# Altium schematic sheet Modulo_Potencia_CEDCP.SchDoc
size A4
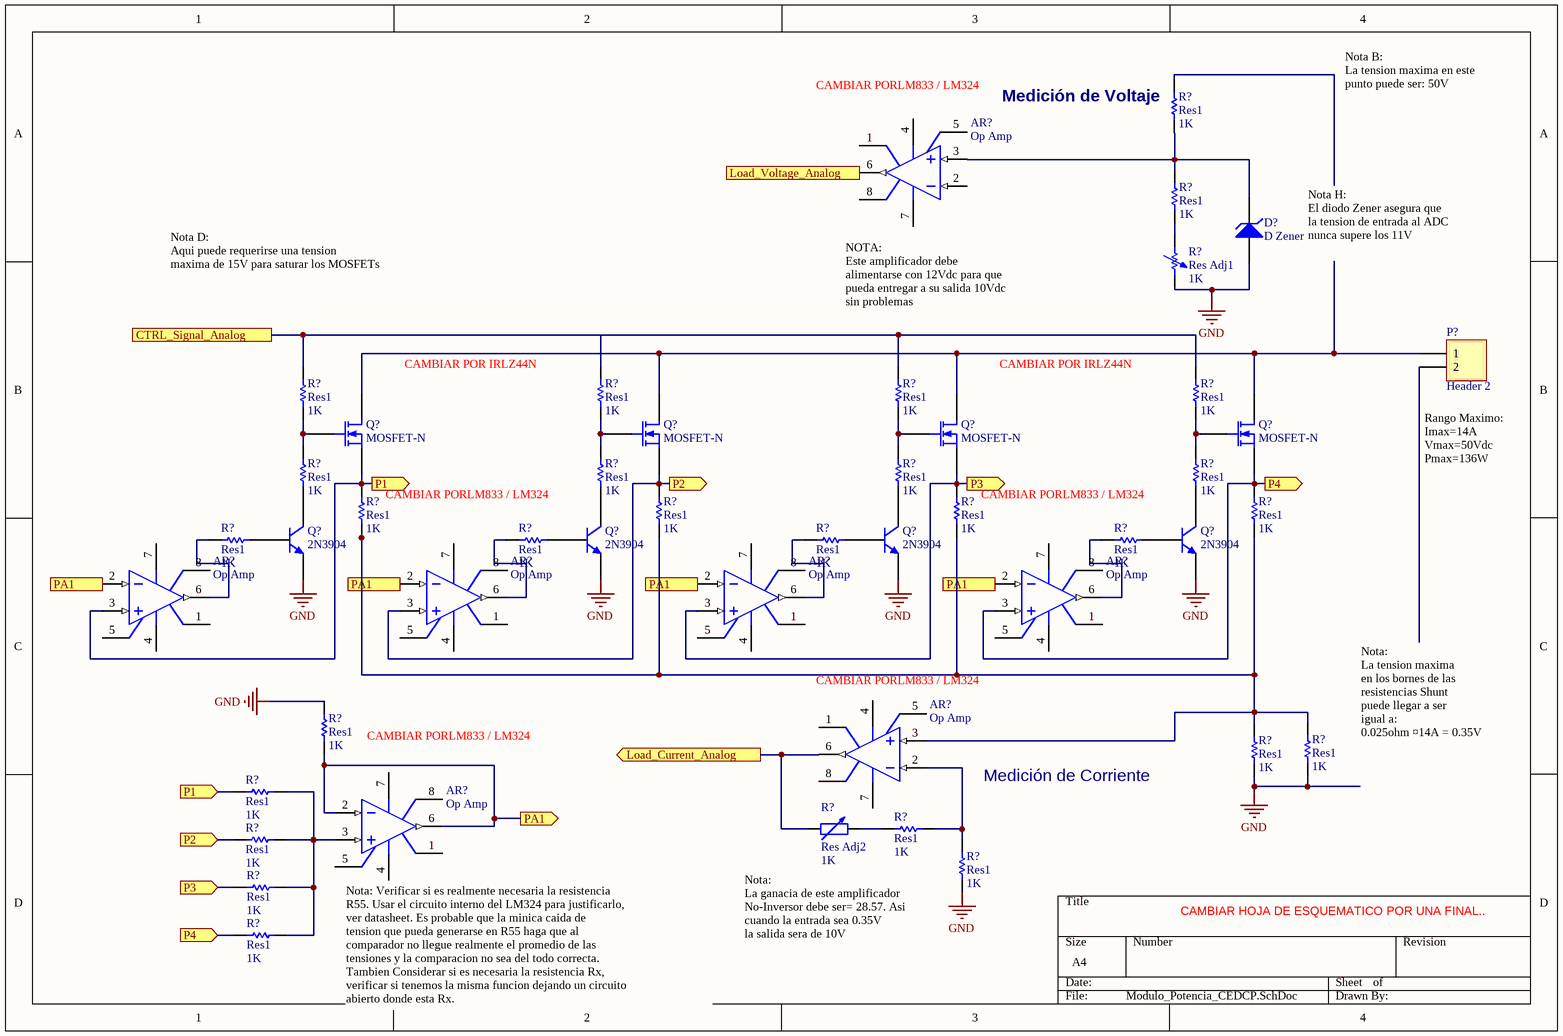
[diagram p0: Modulo_Potencia_CEDCP.SchDoc]

## Parts
(Parts that share a designator on the sheet are numbered #1, #2 ... from top to bottom, then left to right.)
AR?#1  Op Amp  [H-08A]
AR?#2  Op Amp  [H-08A]
AR?#3  Op Amp  [H-08A]
AR?#4  Op Amp  [H-08A]
AR?#5  Op Amp  [H-08A]
AR?#6  Op Amp  [H-08A]
AR?#7  Op Amp  [H-08A]
D?  D Zener  [DIODE-0.7]
P?  Header 2  [HDR1X2]
Q?#1  MOSFET-N  [E3]
Q?#2  MOSFET-N  [E3]
Q?#3  MOSFET-N  [E3]
Q?#4  MOSFET-N  [E3]
Q?#5  2N3904  [TO-92A]
Q?#6  2N3904  [TO-92A]
Q?#7  2N3904  [TO-92A]
Q?#8  2N3904  [TO-92A]
R?#1  Res1  value 1K  [AXIAL-0.3]
R?#2  Res1  value 1K  [AXIAL-0.3]
R?#3  Res Adj1  value 1K  [AXIAL-0.7]
R?#4  Res1  value 1K  [AXIAL-0.3]
R?#5  Res1  value 1K  [AXIAL-0.3]
R?#6  Res1  value 1K  [AXIAL-0.3]
R?#7  Res1  value 1K  [AXIAL-0.3]
R?#8  Res1  value 1K  [AXIAL-0.3]
R?#9  Res1  value 1K  [AXIAL-0.3]
R?#10  Res1  value 1K  [AXIAL-0.3]
R?#11  Res1  value 1K  [AXIAL-0.3]
R?#12  Res1  value 1K  [AXIAL-0.3]
R?#13  Res1  value 1K  [AXIAL-0.3]
R?#14  Res1  value 1K  [AXIAL-0.3]
R?#15  Res1  value 1K  [AXIAL-0.3]
R?#16  Res1  value 1K  [AXIAL-0.3]
R?#17  Res1  value 1K  [AXIAL-0.3]
R?#18  Res1  value 1K  [AXIAL-0.3]
R?#19  Res1  value 1K  [AXIAL-0.3]
R?#20  Res1  value 1K  [AXIAL-0.3]
R?#21  Res1  value 1K  [AXIAL-0.3]
R?#22  Res1  value 1K  [AXIAL-0.3]
R?#23  Res1  value 1K  [AXIAL-0.3]
R?#24  Res Adj2  value 1K  [AXIAL-0.6]
R?#25  Res1  value 1K  [AXIAL-0.3]
R?#26  Res1  value 1K  [AXIAL-0.3]
R?#27  Res1  value 1K  [AXIAL-0.3]
R?#28  Res1  value 1K  [AXIAL-0.3]
R?#29  Res1  value 1K  [AXIAL-0.3]

## Ports
CTRL_Signal_Analog, Load_Current_Analog (out), Load_Voltage_Analog (out), P1 (in), P1 (out), P2 (in), P2 (out), P3 (in), P3 (out), P4 (in), P4 (out), PA1 (in), PA1 (out)

## Nets
GND: D?.1(A) P?.2 Q?#5.1(E) Q?#6.1(E) Q?#7.1(E) Q?#8.1(E) R?#3.2 R?#20.2 R?#21.1 R?#22.1 R?#28.1
CTRL_Signal_Analog: R?#4.2 R?#5.2 R?#6.2 R?#7.2 ; port CTRL_Signal_Analog
Load_Current_Analog: AR?#6.6(OUT) R?#24.1 ; port Load_Current_Analog
Load_Voltage_Analog: AR?#1.6(OUT) ; port Load_Voltage_Analog
P1: AR?#2.3(IN+) Q?#1.3(S) R?#12.2 R?#23.1 ; port P1
P2: AR?#3.3(IN+) Q?#2.3(S) R?#13.2 R?#25.1 ; port P2
P3: AR?#4.3(IN+) Q?#3.3(S) R?#14.2 R?#27.1 ; port P3
P4: AR?#5.3(IN+) Q?#4.3(S) R?#15.2 R?#29.1 ; port P4
PA1: AR?#2.2(IN-) AR?#3.2(IN-) AR?#4.2(IN-) AR?#5.2(IN-) AR?#7.2(IN-) AR?#7.6(OUT) R?#20.1 ; port PA1
NetAR?#1_3: AR?#1.3(IN+) D?.2(K) R?#1.1 R?#2.2
NetAR?#2_6: AR?#2.6(OUT) R?#16.2
NetAR?#3_6: AR?#3.6(OUT) R?#17.2
NetAR?#4_6: AR?#4.6(OUT) R?#18.2
NetAR?#5_6: AR?#5.6(OUT) R?#19.2
NetAR?#6_2: AR?#6.2(IN-) R?#26.1 R?#28.2
NetAR?#6_3: AR?#6.3(IN+) R?#12.1 R?#13.1 R?#14.1 R?#15.1 R?#21.2 R?#22.2
NetAR?#7_3: AR?#7.3(IN+) R?#23.2 R?#25.2 R?#27.2 R?#29.2
NetP?_1: P?.1 Q?#1.1(D) Q?#2.1(D) Q?#3.1(D) Q?#4.1(D) R?#1.2
NetQ?#1_2: Q?#1.2(G) R?#4.1 R?#8.2
NetQ?#2_2: Q?#2.2(G) R?#5.1 R?#9.2
NetQ?#3_2: Q?#3.2(G) R?#6.1 R?#10.2
NetQ?#4_2: Q?#4.2(G) R?#7.1 R?#11.2
NetQ?#5_2: Q?#5.2(B) R?#16.1
NetQ?#5_3: Q?#5.3(C) R?#8.1
NetQ?#6_2: Q?#6.2(B) R?#17.1
NetQ?#6_3: Q?#6.3(C) R?#9.1
NetQ?#7_2: Q?#7.2(B) R?#18.1
NetQ?#7_3: Q?#7.3(C) R?#10.1
NetQ?#8_2: Q?#8.2(B) R?#19.1
NetQ?#8_3: Q?#8.3(C) R?#11.1
NetR?#2_1: R?#2.1 R?#3.1
NetR?#24_2: R?#24.2 R?#26.2

Not connected (* = marked no-connect by the designer): AR?#1 1(OS_NUL) 2(IN-) 4(V-) 5(OS_NUL) 7(V+) 8(TAB); AR?#2 1(OS_NUL) 4(V-) 5(OS_NUL) 7(V+) 8(TAB); AR?#3 1(OS_NUL) 4(V-) 5(OS_NUL) 7(V+) 8(TAB); AR?#4 1(OS_NUL) 4(V-) 5(OS_NUL) 7(V+) 8(TAB); AR?#5 1(OS_NUL) 4(V-) 5(OS_NUL) 7(V+) 8(TAB); AR?#6 1(OS_NUL) 4(V-) 5(OS_NUL) 7(V+) 8(TAB); AR?#7 1(OS_NUL) 4(V-) 5(OS_NUL) 7(V+) 8(TAB)

## Notes on the sheet
- (near AR?#1) CAMBIAR PORLM833 / LM324
- (near R?#1) Medición de Voltaje
- Nota B:
  La tension maxima en este
  punto puede ser: 50V
- Nota D:
  Aqui puede requerirse una tension
  maxima de 15V para saturar los MOSFETs
- (near AR?#1) NOTA:
  Este amplificador debe alimentarse con 12Vdc para que pueda entregar a su salida 10Vdc sin problemas
- Nota H:
  El diodo Zener asegura que
  la tension de entrada al ADC
  nunca supere los 11V
- CAMBIAR POR IRLZ44N
- (near R?#12) CAMBIAR PORLM833 / LM324
- (near R?#14) CAMBIAR PORLM833 / LM324
- (near P?) Rango Maximo:
  Imax=14A
  Vmax=50Vdc
  Pmax=136W
- (near AR?#6) CAMBIAR PORLM833 / LM324
- CAMBIAR PORLM833 / LM324
- Medición de Corriente
- (near R?#22) Nota:
  La tension maxima
  en los bornes de las
  resistencias Shunt
  puede llegar a ser
  igual a:
  0.025ohm ¤14A = 0.35V
- CAMBIAR HOJA DE ESQUEMATICO POR UNA FINAL..
- (near R?#28) Nota:
  La ganacia de este amplificador
  No-Inversor debe ser= 28.57. Asi
  cuando la entrada sea 0.35V
  la salida sera de 10V
- (near AR?#7) Nota: Verificar si es realmente necesaria la resistencia
  R55. Usar el circuito interno del LM324 para justificarlo,
  ver datasheet. Es probable que la minica caida de
  tension que pueda generarse en R55 haga que al
  comparador no llegue realmente el promedio de las
  tensiones y la comparacion no sea del todo correcta.
  Tambien Considerar si es necesaria la resistencia Rx,
  verificar si tenemos la misma funcion dejando un circuito
  abierto donde esta Rx.

## Library data of the parts
AR?#1-AR?#7 = Op Amp: FET Operational Amplifier; Published: 8-Jun-2000; LatestRevisionDate: 17-Jul-2002; LatestRevisionNote: Re-released for DXP Platform.; DatasheetVersion: REV. B; PackageVersion: 1990; PackageReference: H-08A; Publisher: Altium Limited; PackageDescription: Can; 8 Leads; Pin Circle Dia. 5.08 mm; Lead Dia. 0.53 mm (max); ComponentLink1Description: Manufacturer Link; ComponentLink1URL: http://www.analog.com/
D? = D Zener: Zener Diode; Published: 8-Jun-2000; LatestRevisionDate: 17-Jul-2002; LatestRevisionNote: Re-released for DXP Platform.; PackageReference: DIODE-0.7; Publisher: Altium Limited; PackageDescription: Diode, Thru-Hole; 2 Leads; 0.7 in Pin Spacing
P? = Header 2: Header, 2-Pin; LatestRevisionDate: 17-Jul-2002; LatestRevisionNote: Re-released for DXP Platform.; Publisher: Altium Limited
Q?#1-Q?#4 = MOSFET-N: N-Channel MOSFET; Published: 8-Jun-2000; LatestRevisionDate: 17-Jul-2002; LatestRevisionNote: Re-released for DXP Platform.; PackageVersion: 1995/1996; PackageReference: E3; Publisher: Altium Limited; PackageDescription: TO, Flat Index; 3 In-Line, Axial Leads; Body Dia. 4.6mm; Lead Dia. 0.5 mm (max)
Q?#5-Q?#8 = 2N3904: NPN General Purpose Amplifier; Published: 8-Jun-2000; LatestRevisionDate: 15-Jan-2003; LatestRevisionNote: PCB Footprint 'BCY-W3/D4.7' replaced; DatasheetVersion: 1997; PackageVersion: Sep-1998; PackageReference: TO-92A; Publisher: Altium Limited; PackageDescription: TO, Flat Index; 3 In-Line, Axial Leads; Body Dia. 4.5mm; Leads 0.51 x 0.48 mm (max); ComponentLink1Description: Manufacturer Link; ComponentLink1URL: http://www.fairchildsemi.com/; ComponentLink2Description: Datasheet; ComponentLink2URL: http://www.fairchildsemi.com/ds/2N%2F2N3904.pdf
R?#1 R?#2 R?#4-R?#23 R?#25-R?#29 = Res1: Resistor; Published: 8-Jun-2000; LatestRevisionDate: 17-Jul-2002; LatestRevisionNote: Re-released for DXP Platform.; PackageReference: AXIAL-0.3; Publisher: Altium Limited; PackageDescription: Axial Device, Thru-Hole; 2 Leads; 0.3 in Pin Spacing
R?#3 = Res Adj1: Variable Resistor; Set Position: 0.5; Published: 8-Jun-2000; LatestRevisionDate: 17-Jul-2002; LatestRevisionNote: Re-released for DXP Platform.; PackageReference: AXIAL-0.7; Publisher: Altium Limited; PackageDescription: Axial Device, Thru-Hole; 2 Leads; 0.7 in Pin Spacing
R?#24 = Res Adj2: Variable Resistor; Set Position: 0.5; Published: 8-Jun-2000; LatestRevisionDate: 17-Jul-2002; LatestRevisionNote: Re-released for DXP Platform.; PackageReference: AXIAL-0.6; Publisher: Altium Limited; PackageDescription: Axial Device, Thru-Hole; 2 Leads; 0.6 in Pin Spacing